# EAGLE design pendant_board2 (EAGLE 6.5.0)
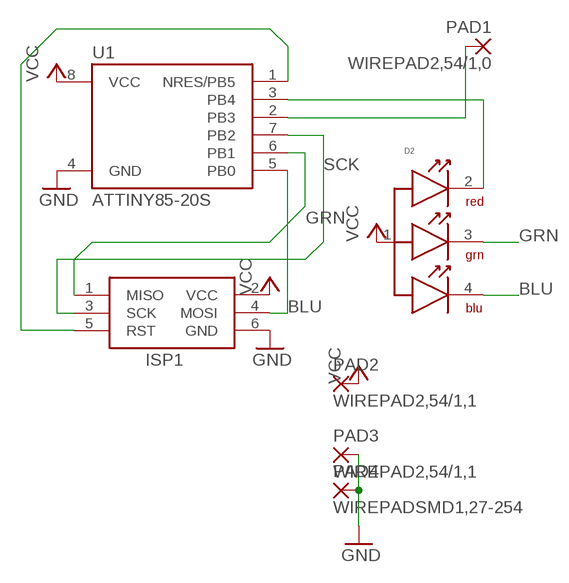
[diagram p0: schematic, sheet 1]

## Parts
D2  SM1210RGB  [SM1210RGB]
ISP1  AVRISP-BOX  [AVRISP-BOX]
PAD1  WIREPAD2,54/1,0  [2,54/1,0]
PAD2  WIREPAD2,54/1,1  [2,54/1,1]
PAD3  WIREPAD2,54/1,1  [2,54/1,1]
PAD4  WIREPADSMD1,27-254  [SMD1,27-2,54]
U1  ATTINY85-20S  [SOIC8_EIAJ_208MIL]

## Nets
BLU: D2.4(BLU) ISP1.4(MOSI) U1.5(PB0)
GND: ISP1.6(GND) PAD3.1(P) PAD4.1(P) U1.4(GND)
GRN: D2.3(GRN) ISP1.1(MISO) U1.6(PB1)
N$1: D2.2(RED) U1.3(PB4)
N$2: PAD1.1(P) U1.2(PB3)
N$5: ISP1.5(RST) U1.1(NRES/PB5)
SCK: ISP1.3(SCK) U1.7(PB2)
VCC: D2.1(VCC) ISP1.2(VCC) PAD2.1(P) U1.8(VCC)

## Library data of the parts
D2 = holly:SM1210RGB: SM1210RGB - RGB LED Technical Specifications: Operating Temperature: -30°C to 80°C Digikey: 492-1243-1-ND
ISP1 = header:AVRISP: AVR ISP HEADER Standard 6 pin header for AVR programming
PAD1-PAD4 = wirepad:WIREPAD: Wire PAD connect wire on PCB
U1 = _hhn_attiny25_45_85:ATTINY85*: ATMEL ATtiny 85 Packages: P = PDIP 08 30mil S = SOIC 08 EIAJ 208mil Technologies Note: for complete ordering code (temp. range, finish, tape&reel etc.) see www.atmel.com • Supply Voltage: V = (1.8…5.5)V | [blank] = (2.7…5.5)V • Speed: 10 = 10 MHz | 20 = 20 MHz Author: Dipl.-Ing. FH Rainer Bayer HHN Hochschule Heilbronn (Heilbronn University), rainer.bayer@hs-heilbronn.de Ingenieurbüro ing-rb, mail@ing-rb.de

## Board
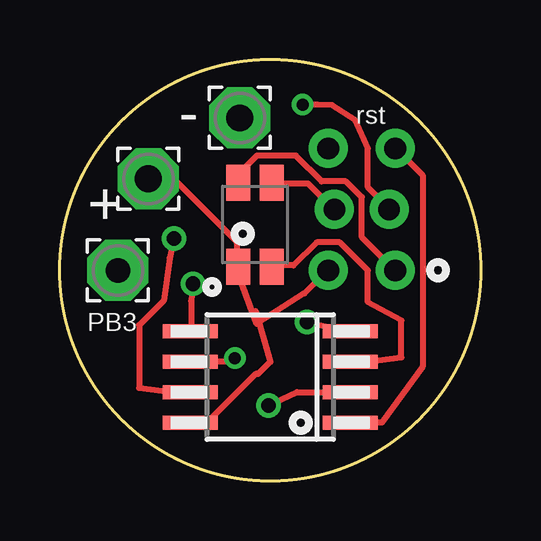
[diagram p1: board, top side]
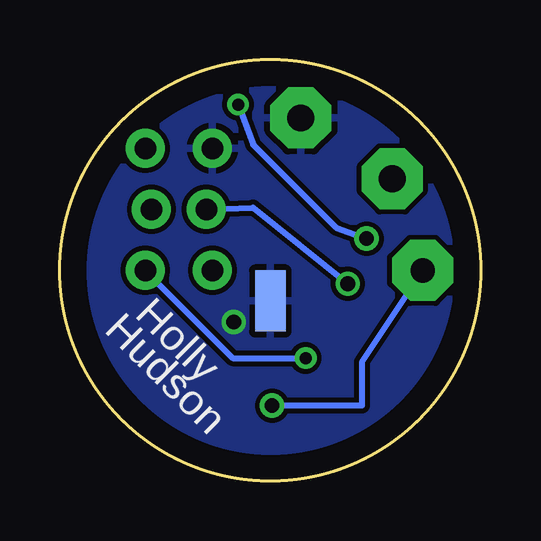
[diagram p2: board, bottom side, seen from below]

Size 17.53 x 17.53 mm. Coordinates in mm from the lower left corner, seen from the top.
Outline: circle at 8.76,8.76 radius 8.76
Copper layers (1*16): Top 0.035mm / dielectric 1.5mm / Bottom 0.035mm
Design rules "default": minimum track width 10mil, minimum drill 24mil, track to track 8mil, track to pad 8mil, pad to pad 8mil, via to via 8mil, smd to smd 8mil, copper to edge 40mil, drill to drill 8mil, minimum pad ring 10mil, minimum via ring 8mil, stop-mask expansion 4mil, vias tented up to drill 0mil, thermal gap 10mil

### Footprints (pad centres in the part's own frame; a part is rotated, then mirrored left to right if it is on the bottom)
SM1210RGB = smd 1 x 1.5: 1 0.7,1.75; 2 -0.7,1.75; 3 0.7,-1.75; 4 -0.7,-1.75
AVRISP-BOX = drill 0.9 pad 1.626: 1 -1.397,2.54; 2 1.397,2.54; 3 -1.143,0; 4 1.143,0; 5 -1.397,-2.54; 6 1.397,-2.54
2,54/1,0 = drill 1.016 pad 2.54 octagon: 1 0,0
2,54/1,1 = drill 1.118 pad 2.54 octagon: 1 0,0
SMD1,27-2,54 = smd 1.27 x 2.54: 1 0,0
SOIC8_EIAJ_208MIL = smd 0.6 x 2.286: 1 -1.905,-3.33; 2 -0.635,-3.33; 3 0.635,-3.33; 4 1.905,-3.33; 5 1.905,3.33; 6 0.635,3.33; 7 -0.635,3.33; 8 -1.905,3.33

### Placement (x,y rotation side)
D2  8.13,10.67 180 top
ISP1  12.57,11.3 180 top
PAD1  2.41,8.76 0 top
PAD2  3.68,12.57 0 top
PAD3  7.49,15.11 0 top
PAD4  8.76,7.49 0 bottom
U1  8.76,4.32 90 top

### Tracks (layer width: path | path; a pad name or v marks a point on that pad's centre or on a via)
BLU  (via drill 0.61)
  Top 0.254: D2.4 8.87,12.37 10.34,12.37 11.4,11.3 ISP1.4 | v5.54,8.2 5.46,7.49 5.46,6.22 U1.5
  Bottom 0.254: v5.54,8.2 9.47,11.38 11.3,11.3 ISP1.4
GND  (via drill 0.61)
  Top 0.254: v10.29,6.6 12.06,6.22 U1.4
  pour Bottom: -0.13,18.92 17.65,18.92 17.65,-0.13 -0.13,-0.13
GRN  (via drill 0.5)
  Top 0.254: D2.3 7.44,12.78 8.2,13.54 9.83,13.54 10.9,12.47 11.91,12.47 12.57,11.81 12.57,10.13 13.95,8.76 ISP1.1 | U1.6 7.14,4.95 v7.29,5.11
  Bottom 0.254: v7.29,5.11 10.34,5.11 13.99,8.76 ISP1.1
N$1
  Top 0.254: U1.3 12.78,4.95 14.22,5.13 14.22,6.68 12.83,7.44 12.83,8.76 11.66,9.93 10.69,9.93 9.73,8.97 8.87,8.97 D2.2
N$2  (via drill 0.61)
  Top 0.254: U1.2 9.88,3.68 v8.69,3.12
  Bottom 0.254: PAD1.1 4.95,4.95 4.95,3.12 v8.69,3.12
N$5
  Top 0.254: U1.1 13.41,2.41 15.11,4.75 15.11,12.72 13.99,13.84 ISP1.5
SCK  (via drill 0.5, 0.61)
  Top 0.254: U1.7 4.75,3.68 3.3,3.86 3.3,6.48 4.32,7.49 4.57,9.27 v4.75,10.08 | v10.11,15.67 10.72,15.67 11.33,15.65 12.29,15.01 12.83,13.84 12.83,12.22 13.74,11.3 ISP1.3
  Bottom 0.254: v4.75,10.08 6.02,10.54 9.47,13.99 v10.11,15.67
VCC
  Top 0.254: 8.2,6.53 7.44,8.56 D2.1 7.39,9.02 7.39,9.93 4.75,12.57 PAD2.1 | 8.2,6.53 10.19,7.8 11.15,8.76 ISP1.2 | U1.8 6.12,2.41 8.15,4.45 8.25,4.45 8.76,4.95 8.15,7.06 8.2,6.53

### Text on the board
tNames: rst | - | + | PB3
bNames: Holly | Hudson